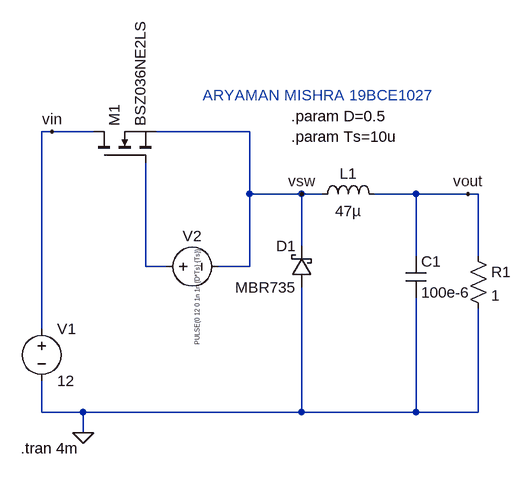
[diagram p0: schematic Draft1.asc]
Draft1.asc, the LTspice schematic file:
Version 4
SHEET 1 880 680
WIRE 80 -16 64 -16
WIRE 144 -16 80 -16
WIRE 384 -16 240 -16
WIRE 384 80 384 -16
WIRE 464 80 384 80
WIRE 496 80 464 80
WIRE 640 80 576 80
WIRE 720 80 640 80
WIRE 736 80 720 80
WIRE 464 160 464 80
WIRE 640 176 640 80
WIRE 736 176 736 80
WIRE 224 192 224 32
WIRE 256 192 224 192
WIRE 384 192 384 80
WIRE 384 192 336 192
WIRE 64 288 64 -16
WIRE 64 416 64 368
WIRE 128 416 64 416
WIRE 464 416 464 224
WIRE 464 416 128 416
WIRE 640 416 640 240
WIRE 640 416 464 416
WIRE 736 416 736 256
WIRE 736 416 640 416
WIRE 128 448 128 416
FLAG 128 448 0
FLAG 80 -16 vin
FLAG 720 80 vout
FLAG 464 80 vsw
SYMBOL voltage 240 192 R270
WINDOW 0 32 56 VTop 2
WINDOW 3 -47 70 Bottom 0
WINDOW 123 0 0 Left 0
WINDOW 39 0 0 Left 0
SYMATTR InstName V2
SYMATTR Value PULSE(0 12 0 1n 1n {D*Ts} {Ts})
SYMBOL schottky 480 224 R180
WINDOW 0 24 64 Left 2
WINDOW 3 24 0 Left 2
SYMATTR InstName D1
SYMATTR Value MBR735
SYMATTR Description Diode
SYMATTR Type diode
SYMBOL ind 480 96 R270
WINDOW 0 32 56 VTop 2
WINDOW 3 5 56 VBottom 2
SYMATTR InstName L1
SYMATTR Value 47µ
SYMBOL cap 624 176 R0
SYMATTR InstName C1
SYMATTR Value 100e-6
SYMBOL res 720 160 R0
SYMATTR InstName R1
SYMATTR Value 1
SYMBOL nmos 144 32 R270
SYMATTR InstName M1
SYMATTR Value BSZ036NE2LS
SYMBOL voltage 64 272 R0
WINDOW 123 0 0 Left 0
WINDOW 39 0 0 Left 0
SYMATTR InstName V1
SYMATTR Value 12
TEXT 312 -72 Left 2 ;ARYAMAN MISHRA 19BCE1027
TEXT 448 -40 Left 2 !.param D=0.5
TEXT 448 -8 Left 2 !.param Ts=10u
TEXT 32 472 Left 2 !.tran 4m

The netlist it stands for:
* Draft1.asc
V2 N001 vsw PULSE(0 12 0 1n 1n {D*Ts} {Ts})
D1 0 vsw MBR735
L1 vsw vout 47µ
C1 vout 0 100e-6
R1 vout 0 1
M1 vin N001 vsw vsw BSZ036NE2LS
V1 vin 0 12
.model D D
.lib standard.dio
.model NMOS NMOS
.model PMOS PMOS
.lib standard.mos
* ARYAMAN MISHRA 19BCE1027
.param D=0.5
.param Ts=10u
.tran 4m
.backanno
.end